# Altium schematic sheet Fri3D_2024_00.SchDoc: Top Level
size A3; Date: 22/06/2023; DrawnBy: Wim Van Gool; DocumentNumber: 1; Revision: 00; SheetNumber: 1; SheetTotal: 4
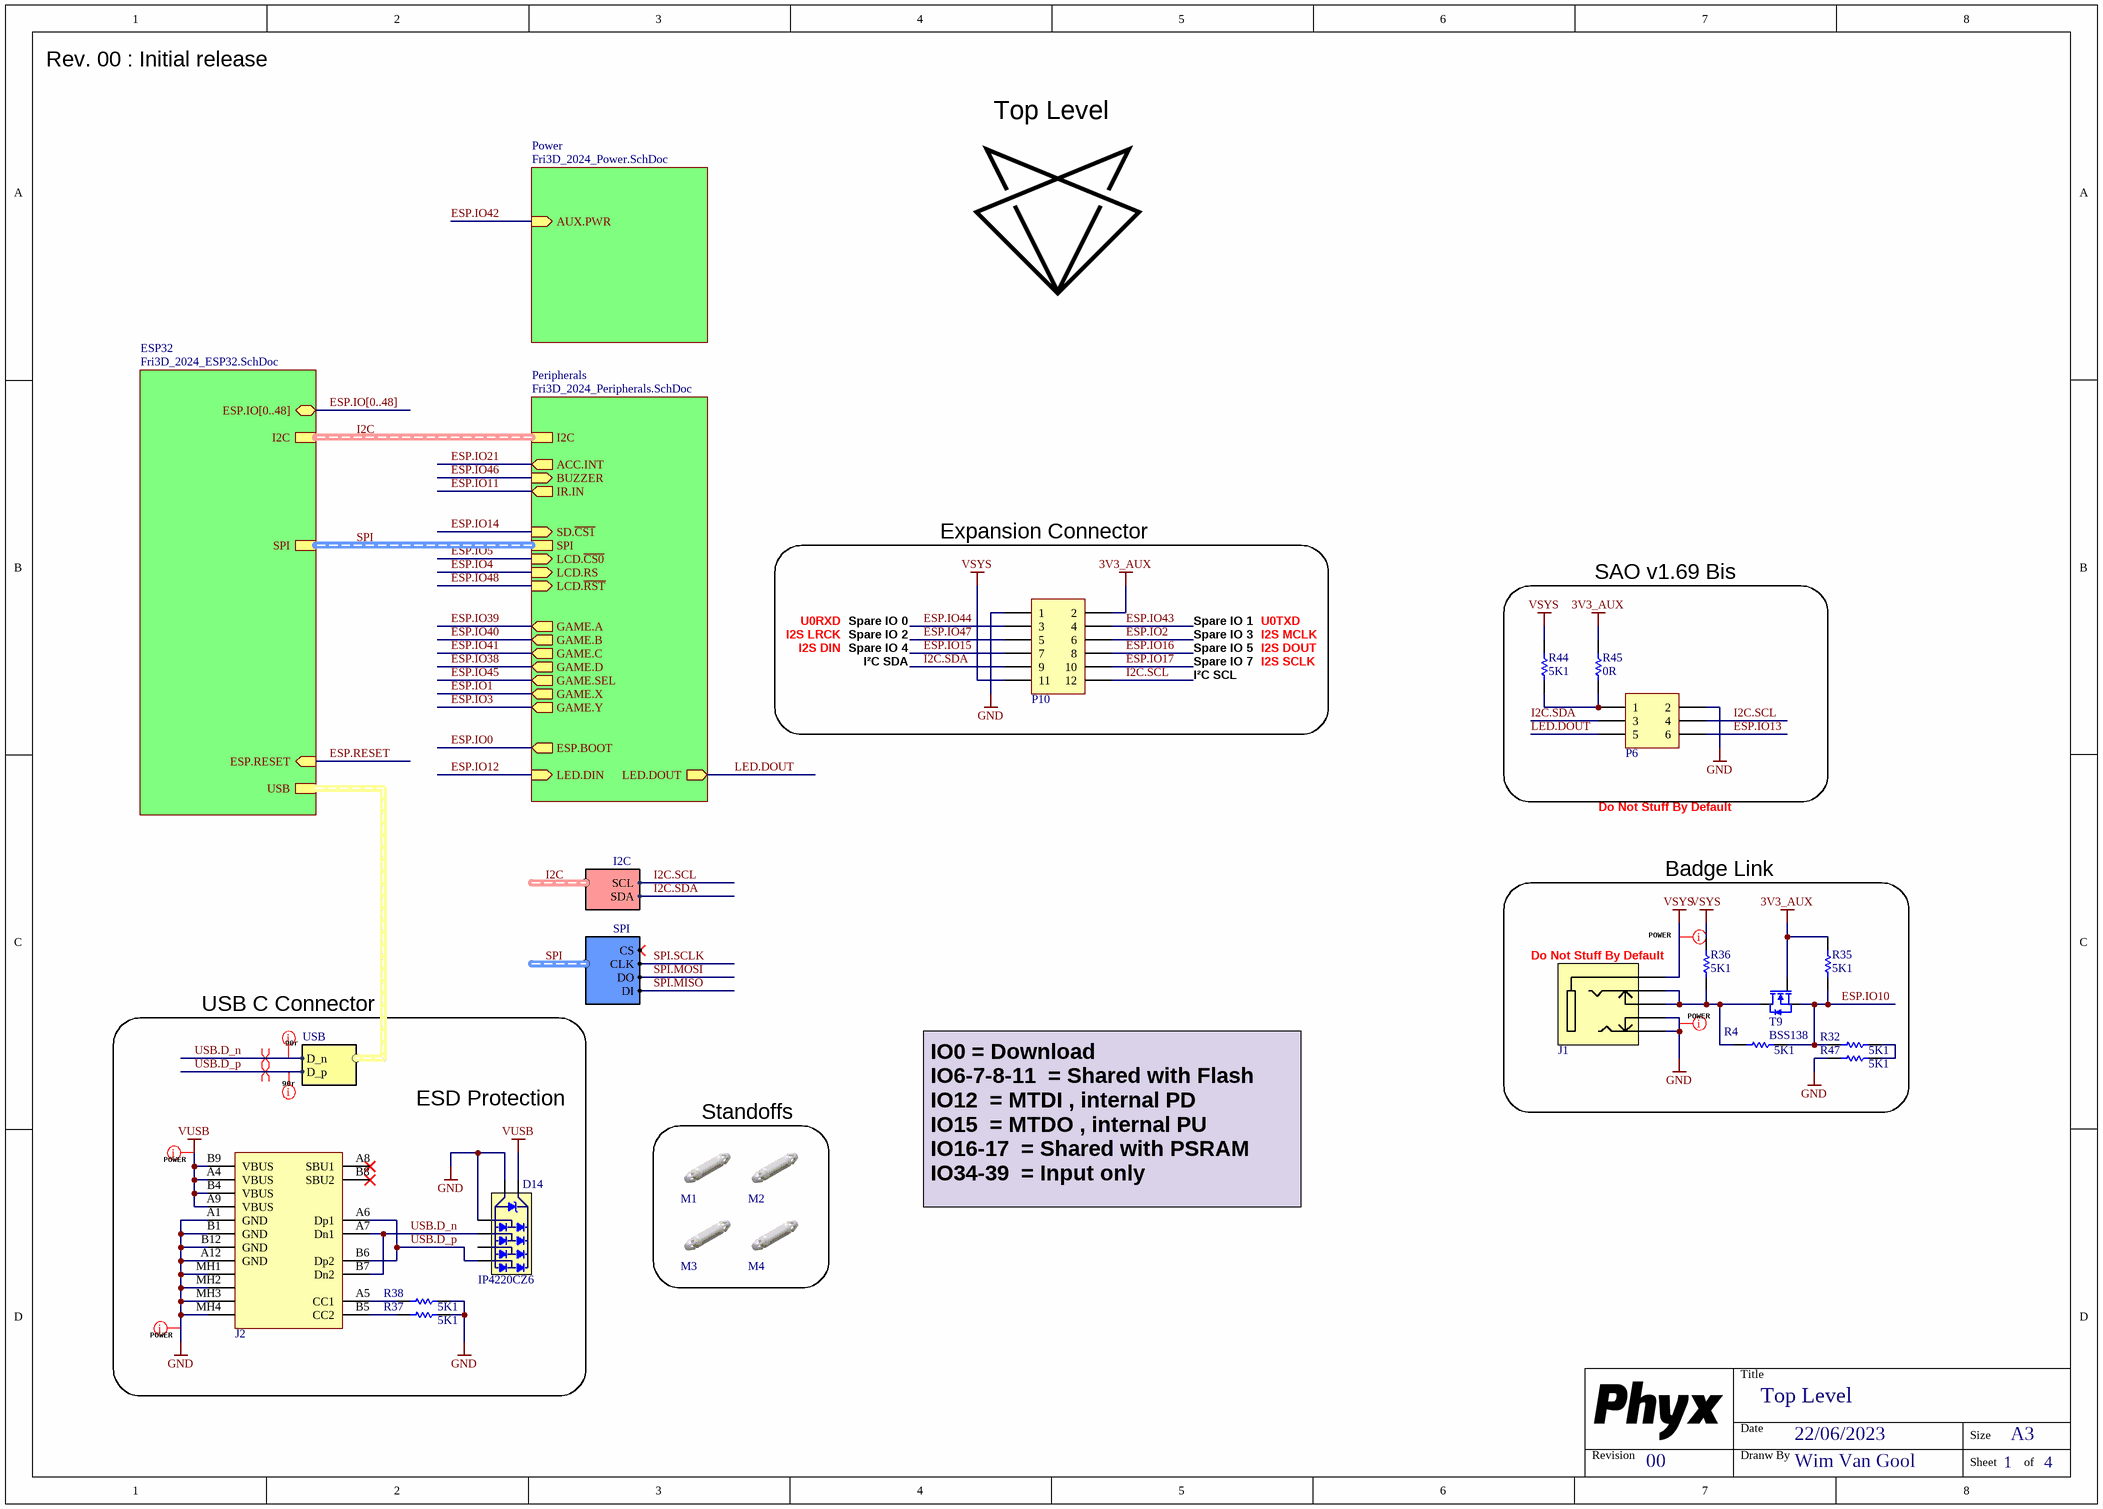
[diagram p0: Fri3D_2024_00.SchDoc]

## Parts
D14  value IP4220CZ6  [NXP_SOT457]  (hidden comment: TVS Diode Dual USB)
J1  3.5mm jack, dual switch, black, 3 contacts  [CUI_SJ1-3525NG]  (value not drawn)
J2  USB 2.0 C Reversible Receptacle Horizontal full SMD  [XUNPU-TYPEC-304S-ACP16]  (value not drawn)
M1  HIWA LCC-12 Snap-in - Snap-in 12.7mm  [WE_709622400]  (value not drawn)
M2  HIWA LCC-12 Snap-in - Snap-in 12.7mm  [WE_709622400]  (value not drawn)
M3  HIWA LCC-12 Snap-in - Snap-in 12.7mm  [WE_709622400]  (value not drawn)
M4  HIWA LCC-12 Snap-in - Snap-in 12.7mm  [WE_709622400]  (value not drawn)
P6  Receptacle 3x2  [RCPT2X3]  (value not drawn)
P10  Receptacle 6x2 SMD low profile  [WE_610312243021_POST]  (value not drawn)
R4  value 5K1  [R0603_N]  (hidden comment: RESISTOR)
R32  value 5K1  [R0603_N]  (hidden comment: RESISTOR)
R35  value 5K1  [R0603_N]  (hidden comment: RESISTOR)
R36  value 5K1  [R0603_N]  (hidden comment: RESISTOR)
R37  value 5K1  [R0603_N]  (hidden comment: RESISTOR)
R38  value 5K1  [R0603_N]  (hidden comment: RESISTOR)
R44  value 5K1  [R0603_N]  (hidden comment: RESISTOR)
R45  value 0R  [R0603_N]  (hidden comment: RESISTOR)
R47  value 5K1  [R0603_N]  (hidden comment: RESISTOR)
T9  value BSS138  [SOT23-3]  (hidden comment: 0.2A N-Ch MOSFET Vgs 3.2)

## Blocks framed on the sheet
Expansion Connector: P10
SAO v1.69 Bis: P6 R44 R45
Badge Link: J1 R4 R32 R35 R36 R47 T9
Standoffs: M1-M4

## Sub-sheets
ESP32 = Fri3D_2024_ESP32.SchDoc: I2C (harness I2C), USB (harness USB), SPI (harness SPI), ESP.RESET (in), ESP.IO[0..48] (bidir)
Peripherals = Fri3D_2024_Peripherals.SchDoc: I2C (harness I2C), ACC.INT (out), BUZZER (in), LED.DIN (in), LED.DOUT (out), SPI (harness SPI), IR.IN (out), LCD.RS (in), LCD.~{RST} (in), LCD.~{CS0} (in), ESP.BOOT (out), GAME.A (out), GAME.B (out), GAME.C (out), GAME.D (out), GAME.SEL (out), SD.~{CS1} (in), GAME.X (out), GAME.Y (out)
Power = Fri3D_2024_Power.SchDoc: AUX.PWR (in)

## Harnesses
USB: D_p, D_n
I2C: SDA, SCL
SPI: CS, CLK, DO, DI

## Nets
3V3_AUX: P10.2 R35.1 R45.1 T9.1(G)
GND: D14.2(GND) D14.3 J1.2(Tip) J1.4 J2.A1(GND) J2.A12(GND) J2.B1(GND) J2.B12(GND) J2.MH1(Tab) J2.MH2(Tab) J2.MH3(Tab) J2.MH4(Tab) P6.2 P10.1 R37.2 R38.2 R47.2
VSYS: J1.1(Sleeve) P10.11 R36.1 R44.2
VUSB: D14.5(VBus) J2.A4(VBUS) J2.A9(VBUS) J2.B4(VBUS) J2.B9(VBUS)
ESP.IO0: sheet Peripherals/ESP.BOOT
ESP.IO1: sheet Peripherals/GAME.X
ESP.IO2: P10.6
ESP.IO3: sheet Peripherals/GAME.Y
ESP.IO4: sheet Peripherals/LCD.RS
ESP.IO5: sheet Peripherals/LCD.~{CS0}
ESP.IO10: R4.1 R32.2 R35.2 T9.2(S)
ESP.IO11: sheet Peripherals/IR.IN
ESP.IO12: sheet Peripherals/LED.DIN
ESP.IO13: P6.6
ESP.IO14: sheet Peripherals/SD.~{CS1}
ESP.IO15: P10.7
ESP.IO16: P10.8
ESP.IO17: P10.10
ESP.IO21: sheet Peripherals/ACC.INT
ESP.IO38: sheet Peripherals/GAME.D
ESP.IO39: sheet Peripherals/GAME.A
ESP.IO40: sheet Peripherals/GAME.B
ESP.IO41: sheet Peripherals/GAME.C
ESP.IO42: sheet Power/AUX.PWR
ESP.IO43: P10.4
ESP.IO44: P10.3
ESP.IO45: sheet Peripherals/GAME.SEL
ESP.IO46: sheet Peripherals/BUZZER
ESP.IO47: P10.5
ESP.IO48: sheet Peripherals/LCD.~{RST}
ESP.RESET: sheet ESP32/ESP.RESET
I2C.SCL: P6.4 P10.12 ; sheet Peripherals/I2C.SCL
I2C.SDA: P6.3 P10.9 ; sheet Peripherals/I2C.SDA
LED.DOUT: P6.5 ; sheet Peripherals/LED.DOUT
SPI.MISO: sheet Peripherals/SPI.DI  [project net SPI.DI]
SPI.MOSI: sheet Peripherals/SPI.DO  [project net SPI.DO]
SPI.SCLK: sheet Peripherals/SPI.CLK  [project net SPI.CLK]
USB.D_n: D14.1 J2.A7(Dn1) J2.B7(Dn2) ; sheet ESP32/USB.D_n
USB.D_p: D14.6 J2.A6(Dp1) J2.B6(Dp2) ; sheet ESP32/USB.D_p
NetJ1_3: J1.3(Ring) J1.5 R4.2 R36.2 T9.3(D)
NetJ2_A5: J2.A5(CC1) R38.1
NetJ2_B5: J2.B5(CC2) R37.1
NetP6_1: P6.1 R44.1 R45.2
NetR32_1: R32.1 R47.1

Not connected (* = marked no-connect by the designer): D14 4; J2 A8(SBU1)* B8(SBU2)*

## Buses and harness runs
bus ESP.IO[0..48] = sheet ESP32/ESP.IO[0..48]
harness I2C = sheet ESP32/I2C = sheet Peripherals/I2C
harness SPI = sheet ESP32/SPI = sheet Peripherals/SPI

## Layout directives
net class 90r: USB.D_n, USB.D_p
differential pair: USB.D_n, USB.D_p
net class POWER: GND, VSYS, VUSB

## Notes on the sheet
- Rev. 00 : Initial release
- I2S LRCK
- I2S DIN
- U0RXD
- Spare IO 0
- I²C SDA
- Spare IO 2
- Spare IO 4
- Spare IO 1
- Spare IO 3
- Spare IO 5
- Spare IO 7
- I2S MCLK
- I2S SCLK
- I2S DOUT
- U0TXD
- I²C SCL
- Do Not Stuff By Default
- (near J1) Do Not Stuff By Default
- USB C Connector
- ESD Protection
- IO0	= Download
  IO6-7-8-11 	= Shared with Flash
  IO12 	= MTDI , internal PD
  IO15 	= MTDO , internal PU
  IO16-17 	= Shared with PSRAM
  IO34-39 	= Input only
- Title
- Revision
- Date
- Dranw By
- Size
- A3
- Sheet
- of

## Library data of the parts
D14 = TVS # IP4220CZ6 Dual USB: =Description; Supplier 1: Farnell; Supplier Part Number 1: 2143248
J1 = AUDIO JACK 3.5 3c SJ1-3525NG: =Description; Value: SJ1-3525NG; Supplier 1: Digi-key; Supplier Part Number 1: CP1-3525NG-ND
J2 = USB # C 2.0 RCPT TYPEC-304S-ACP16: Value: TYPEC-304S-ACP16; Supplier 1: LCSC; Supplier Part Number 1: C720630
M1-M4 = SPACER SNAP-SNAP LCC-12 -12.7mm: Description: SPACER SNAP-SNAP LCC-12 -12.7mm; Value: LCC-12; Supplier 1: LCSC; Supplier Part Number 1: C155856
P6 = Receptacle 2.54mm dual row 6way
P10 = Receptacle # 2.54mm dual row 12way 610312243021: Value: 610312243021; Supplier 1: Wurth; Supplier Part Number 1: 610312243021; Supplier 2: Mouser; Supplier Part Number 2: 710-610312243021
R4 R32 R35-R38 R44 R47 = RES # 5K1 0603: Supplier 1: Farnell; Supplier Part Number 1: 2845922
  R4 R36: Supplier 2: LCSC; Supplier Part Number 2: C112314; Supplier 3: Generic; Supplier Part Number 3: 5K1 1% 0603
R45 = RES # 0R 0603: Supplier 1: Farnell; Supplier Part Number 1: 2447743; Supplier 3: Generic; Supplier Part Number 3: 0R 1% 0603
T9 = BSS138 N-Ch MOSFET 0.2A 3.2Vgs 60Vds: Supplier 1: Farnell; Supplier Part Number 1: 2432717